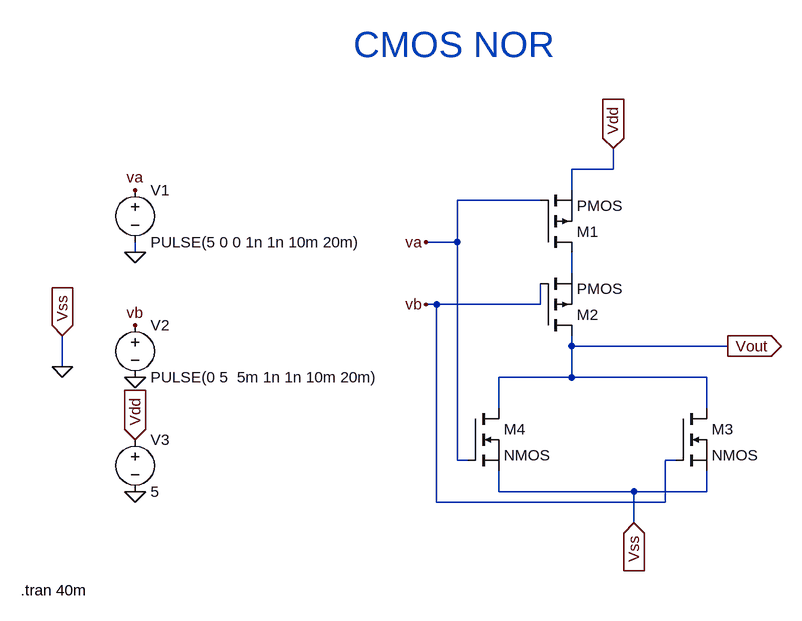
[diagram p0: schematic CMOS NOR.asc]
CMOS NOR.asc, the LTspice schematic file:
Version 4.1
SHEET 1 880 680
WIRE 256 -96 256 -128
WIRE 256 -96 192 -96
WIRE 192 -64 192 -96
WIRE 144 -48 16 -48
WIRE 16 16 16 -48
WIRE 16 16 -32 16
WIRE -480 32 -480 16
WIRE 192 64 192 32
WIRE -16 112 -32 112
WIRE 144 112 144 80
WIRE 144 112 -16 112
WIRE 192 176 192 160
WIRE 432 176 192 176
WIRE -592 208 -592 160
WIRE 192 224 192 176
WIRE 192 224 80 224
WIRE 400 224 192 224
WIRE 80 272 80 224
WIRE 400 272 400 224
WIRE 16 352 16 16
WIRE 32 352 16 352
WIRE 352 352 336 352
WIRE 80 400 80 368
WIRE 288 400 80 400
WIRE 400 400 400 368
WIRE 400 400 288 400
WIRE -16 416 -16 112
WIRE 336 416 336 352
WIRE 336 416 -16 416
WIRE 288 448 288 400
FLAG 432 176 Vout
IOPIN 432 176 Out
FLAG 256 -128 Vdd
IOPIN 256 -128 In
FLAG 288 448 Vss
IOPIN 288 448 In
FLAG -592 208 0
FLAG -480 -64 va
FLAG -32 16 va
FLAG -32 112 vb
FLAG -480 144 vb
FLAG -480 320 Vdd
IOPIN -480 320 In
FLAG -592 160 Vss
IOPIN -592 160 In
FLAG -480 224 0
FLAG -480 400 0
FLAG -480 32 0
SYMBOL pmos 144 32 M180
SYMATTR InstName M1
SYMBOL pmos 144 160 M180
SYMATTR InstName M2
SYMBOL nmos 352 272 R0
SYMATTR InstName M3
SYMBOL nmos 32 272 R0
SYMATTR InstName M4
SYMBOL voltage -480 -80 R0
SYMATTR InstName V1
SYMATTR Value PULSE(5 0 0 1n 1n 10m 20m)
SYMBOL voltage -480 128 R0
SYMATTR InstName V2
SYMATTR Value PULSE(0 5  5m 1n 1n 10m 20m)
SYMBOL voltage -480 304 R0
SYMATTR InstName V3
SYMATTR Value 5
TEXT -656 552 Left 2 !.tran 40m
TEXT -144 -288 Left 5 ;CMOS NOR

The netlist it stands for:
* CMOS NOR.asc
M1 N001 va Vdd Vdd PMOS
M2 Vout vb N001 N001 PMOS
M3 Vout vb 0 0 NMOS
M4 Vout va 0 0 NMOS
V1 va 0 PULSE(5 0 0 1n 1n 10m 20m)
V2 vb 0 PULSE(0 5  5m 1n 1n 10m 20m)
V3 Vdd 0 5
.model NMOS NMOS
.model PMOS PMOS
.lib standard.mos
.tran 40m
* CMOS NOR
.backanno
.end